# EAGLE design switchotron-3buttons-3lights-v1 (EAGLE 9.6.2)
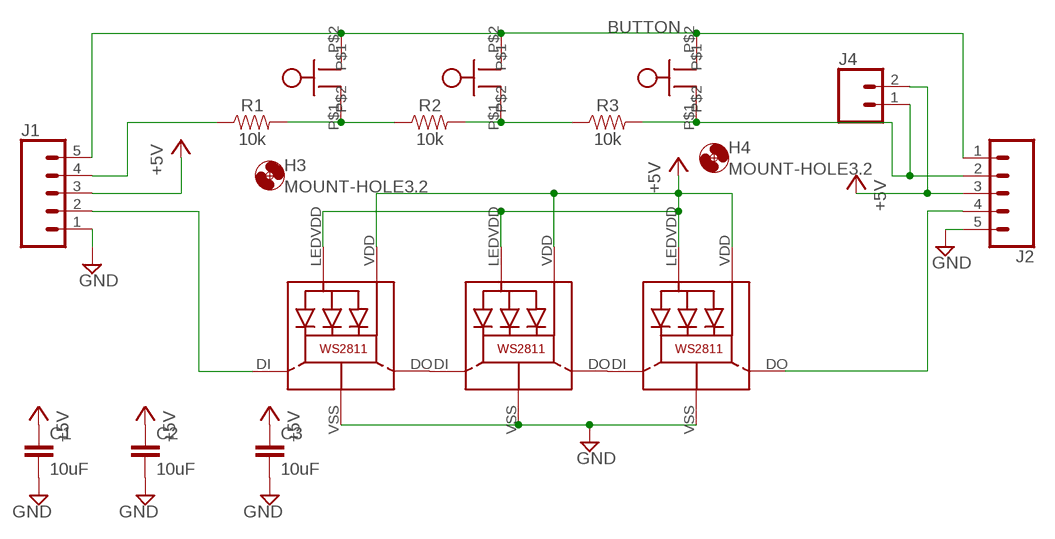
[diagram p0: schematic, sheet 1]

## Parts
C1  10uF  10UF-0603-6.3V-20%  [0603]
C2  10uF  10UF-0603-6.3V-20%  [0603]
C3  10uF  10UF-0603-6.3V-20%  [0603]
H3  MOUNT-HOLE3.2  [3,2]
H4  MOUNT-HOLE3.2  [3,2]
J1  CONN_05  [1X05]
J2  CONN_05  [1X05]
J4  CONN_02  [1X02]
LED1  WS28115050  [WS28115050]
LED2  WS28115050  [WS28115050]
LED8  WS28115050  [WS28115050]
R1  10k  10KOHM-0603-1/10W-1%  [0603]
R2  10k  10KOHM-0603-1/10W-1%  [0603]
R3  10k  10KOHM-0603-1/10W-1%  [0603]
U$1  BUTTON  [BUTTON]
U$4  BUTTON  [BUTTON]
U$5  BUTTON  [BUTTON]

## Nets
+5V: C1.1 C2.1 C3.1 J1.3 J2.3 J4.2 LED1.LEDVDD LED1.VDD LED2.LEDVDD LED2.VDD LED8.LEDVDD LED8.VDD
BUTTON: J1.5 J2.1 U$1.P$2 U$4.P$2 U$5.P$2
GND: C1.2 C2.2 C3.2 J1.1 J2.5 LED1.VSS(GND) LED2.VSS(GND) LED8.VSS(GND)
N$1: LED1.DO LED2.DI
N$2: R1.2 R2.1 U$1.P$1
N$3: R2.2 R3.1 U$4.P$1
N$4: J2.2 J4.1 R3.2 U$5.P$1
N$5: J1.4 R1.1
N$7: LED2.DO LED8.DI
N$8: J1.2 LED1.DI
N$9: J2.4 LED8.DO

## Library data of the parts
C1-C3 = SparkFun-Capacitors:10UF: 10.0µF ceramic capacitors A capacitor is a passive two-terminal electrical component used to store electrical energy temporarily in an electric field.; PROD_ID: CAP-11015
H3 H4 = holes:MOUNT-HOLE: MOUNTING HOLE with drill center marker
J1 J2 = SparkFun-Connectors:CONN_05: Multi connection point. Often used as Generic Header-pin footprint for 0.1 inch spaced/style header connections On any of the 0.1 inch spaced packages, you can populate with these: Break Away Headers - Straight <https://www.sparkfun.com/products/116> (PRT-00116) Break Away Male Headers - Right Angle <https://www.sparkfun.com/products/553> (PRT-00553) Female Headers <https://www.sparkfun.com/products/115> (PRT-00115) Break Away Headers - Machine Pin <https://www.sparkfun.com/products/117> (PRT-00117) Break Away Female Headers - Swiss Machine Pin <https://www.sparkfun.com/products/743> (PRT-00743) For SCREWTERMINALS and SPRING TERMINALS visit here: Screw Terimnals on SparkFun.com <https://www.sparkfun.com/search/results?term=Screw+Terminals> (5mm/3.5mm/2.54mm spacing) This device is also useful as a general connection point to wire up your design to another part of your project. Our various solder wires solder well into these plated through hole pads. Hook-Up Wire - Assortment (Stranded, 22 AWG) <https://www.sparkfun.com/products/11375> (PRT-11375) Hook-Up Wire - Assortment (Solid Core, 22 AWG) <https://www.sparkfun.com/products/11367> (PRT-11367) View the entire wire category on our website here <https://www.sparkfun.com/categories/141> Special notes: Molex polarized connector foot print use with SKU : PRT-08231 with associated crimp pins and housings. 1MM SMD Version SKU: PRT-10208
J4 = SparkFun-Connectors:CONN_02: Multi connection point. Often used as Generic Header-pin footprint for 0.1 inch spaced/style header connections On any of the 0.1 inch spaced packages, you can populate with these: Break Away Headers - Straight <https://www.sparkfun.com/products/116> (PRT-00116) Break Away Male Headers - Right Angle <https://www.sparkfun.com/products/553> (PRT-00553) Female Headers <https://www.sparkfun.com/products/115> (PRT-00115) Break Away Headers - Machine Pin <https://www.sparkfun.com/products/117> (PRT-00117) Break Away Female Headers - Swiss Machine Pin <https://www.sparkfun.com/products/743> (PRT-00743) For SCREWTERMINALS and SPRING TERMINALS visit here: Screw Terimnals on SparkFun.com <https://www.sparkfun.com/search/results?term=Screw+Terminals> (5mm/3.5mm/2.54mm spacing) This device is also useful as a general connection point to wire up your design to another part of your project. Our various solder wires solder well into these plated through hole pads. Hook-Up Wire - Assortment (Stranded, 22 AWG) <https://www.sparkfun.com/products/11375> (PRT-11375) Hook-Up Wire - Assortment (Solid Core, 22 AWG) <https://www.sparkfun.com/products/11367> (PRT-11367) View the entire wire category on our website here <https://www.sparkfun.com/categories/141> Special notes: Molex polarized connector foot print use with: PRT-08233 with associated crimp pins and housings. 2.54_SCREWTERM for use with PRT-10571. 3.5mm Screw Terminal footprints for PRT-08084 5mm Screw Terminal footprints for use with PRT-08432
LED1 LED2 LED8 = microbuilder:WS28115050
R1-R3 = SparkFun-Resistors:10KOHM: 10kΩ resistor A resistor is a passive two-terminal electrical component that implements electrical resistance as a circuit element. Resistors act to reduce current flow, and, at the same time, act to lower voltage levels within circuits. - Wikipedia; PROD_ID: RES-00824
U$1 U$4 U$5 = spietz-library-2:BUTTON

## Board
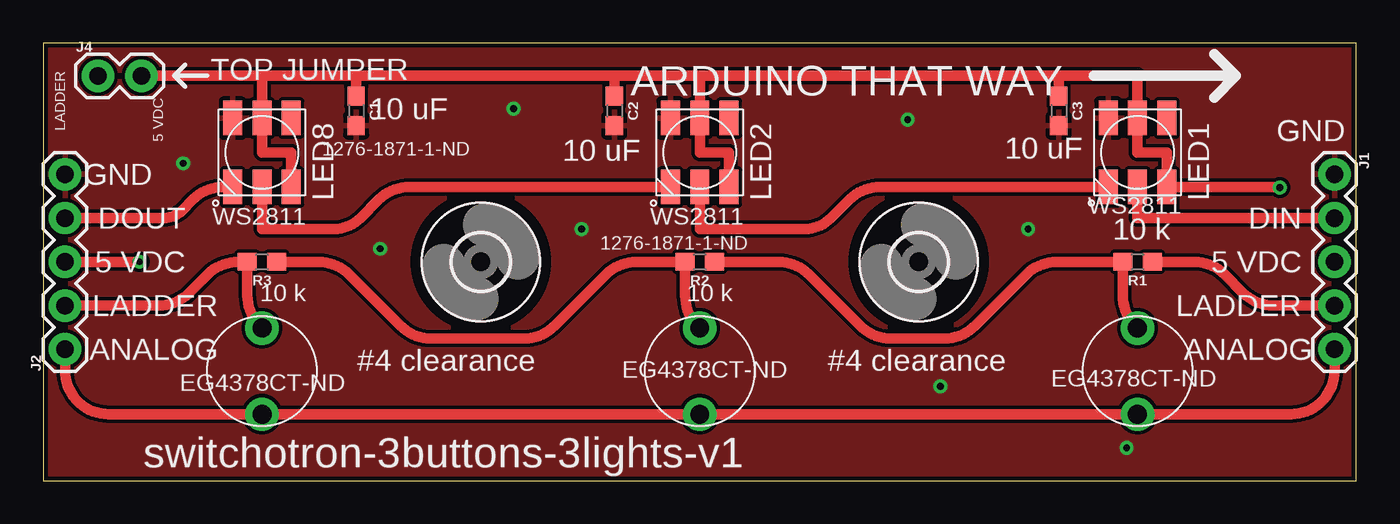
[diagram p1: board, top side]
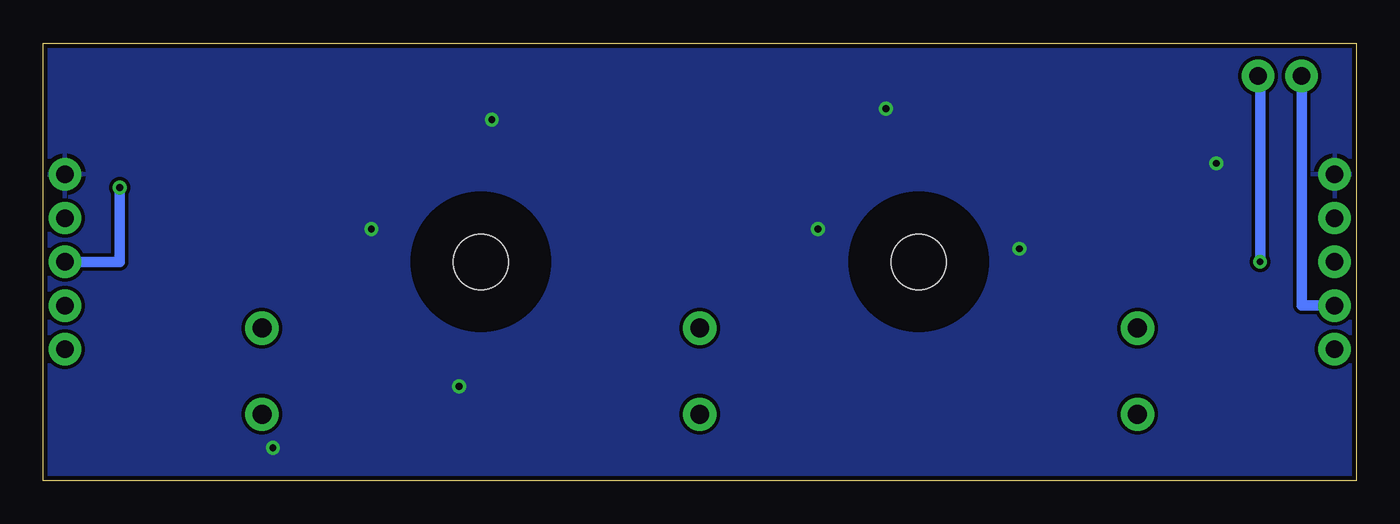
[diagram p2: board, bottom side, seen from below]

Size 76.2 x 25.4 mm. Coordinates in mm from the lower left corner, seen from the top.
Outline: 76.2,25.4 0,25.4 0,0 76.2,0 76.2,25.4
Copper layers (1*16): Top 0.035mm / dielectric 1.5mm / Bottom 0.035mm
Design rules "adafruit *": minimum track width 8mil, minimum drill 15.5mil, track to track 8mil, track to pad 8mil, pad to pad 8mil, via to via 8mil, smd to smd 8mil, copper to edge 10mil, drill to drill 8mil, minimum pad ring 10mil, minimum via ring 8mil, stop-mask expansion 4mil, vias tented up to drill 20mil, thermal gap 10mil

### Footprints (pad centres in the part's own frame; a part is rotated, then mirrored left to right if it is on the bottom)
0603 = smd 1.1 x 1: 1 -0.85,0; 2 0.85,0
3,2 = hole 3.2: 0,0
1X05 = drill 1.016 pad 1.88: 1 0,0; 2 2.54,0; 3 5.08,0; 4 7.62,0; 5 10.16,0
1X02 = drill 1.016 pad 1.88: 1 0,0; 2 2.54,0
WS28115050 = smd 2 x 1.1: DI 2,0; DO 2,-1.7; LEDVDD -2,0; NC -2,1.7; VDD 2,1.7; VSS -2,-1.7
BUTTON = drill 1.1 pad 1.93: P$1 -2.499,0; P$2 2.499,0

### Placement (x,y rotation side)
C1  18.16,21.46 270 top
C2  33.15,21.46 270 top
C3  58.93,21.46 270 top
H3  50.8,12.7 180 top
H4  25.4,12.7 180 top
J1  74.93,17.78 270 top
J2  1.27,7.62 90 top
J4  3.17,23.5 0 top
LED1  63.5,19.05 270 top
LED2  38.1,19.05 270 top
LED8  12.7,19.05 270 top
R1  63.5,12.7 180 top
R2  38.1,12.7 180 top
R3  12.7,12.7 180 top
U$1  63.5,6.35 270 top
U$4  38.1,6.35 270 top
U$5  12.7,6.35 270 top

### Tracks (layer width: path | path; a pad name or v marks a point on that pad's centre or on a via)
+5V  (via drill 0.39)
  Top 0.61: J2.3 v5.59,12.7 | LED8.VDD 14.4,19.05 12.7,19.05 LED8.LEDVDD 12.7,23.5 | J4.2 12.7,23.5 | LED2.VDD 39.8,19.05 38.1,19.05 LED2.LEDVDD 38.1,23.5 | 18.04,23.5 33.15,23.5 | 18.04,23.5 18.16,23.5 C1.1 | 18.04,23.5 12.7,23.5 | 33.15,23.5 38.1,23.5 | 38.1,23.5 58.93,23.5 | 58.93,23.5 63.5,23.5 LED1.LEDVDD 63.5,19.05 65.2,19.05 LED1.VDD 71.75,17.05 v71.75,17.02 | C2.1 33.15,23.5 | C3.1 58.93,23.5
  Bottom 0.61: J1.3 71.75,12.7 v71.75,17.02 | J4.2 5.59,23.5 v5.59,12.7
BUTTON
  Top 0.61: J1.5 74.93,6.39 arc-90 72.39,3.85 U$1.P$2 U$4.P$2 U$5.P$2 3.81,3.85 arc-90 1.27,6.39 J2.1
GND  (via drill 0.39)
  other vias: 62.87,1.91 52.07,5.46 57.15,14.61 27.3,21.59 8.13,18.41 50.16,20.95 19.56,13.46 31.24,14.61
  pour Top: 76.2,0 76.2,25.4 0,25.4 0,0
  pour Bottom: 76.2,0 76.2,25.4 0,25.4 0,0
N$1
  Top 0.61: LED1.DO 48.58,17.05 arc45 46.79,16.31 45.72,15.24 arc-45 44.19,14.61 38.1,14.61 LED2.DI
N$2
  Top 0.61: R2.1 42.64,12.7 arc-45 44.43,11.96 47.39,9 arc45 49.19,8.26 52.29,8.26 arc45 54.08,9 57.04,11.96 arc-45 58.84,12.7 R1.2 62.65,10.75 arc45 63.39,8.96 U$1.P$1
N$3
  Top 0.61: R3.1 15.97,12.7 arc-45 17.76,11.96 20.72,9 arc45 22.52,8.26 27.9,8.26 arc45 29.7,9 32.66,11.96 arc-45 34.45,12.7 R2.2 37.25,10.75 arc45 37.99,8.96 U$4.P$1
N$4
  Top 0.61: J2.2 6.7,10.16 arc45 8.49,10.9 9.54,11.96 arc-45 11.34,12.7 R3.2 11.85,10.75 arc45 12.59,8.96 U$5.P$1
  Bottom 0.61: J4.1 3.17,10.16 J2.2
N$5
  Top 0.61: R1.1 66.77,12.7 arc-45 68.56,11.96 69.61,10.9 arc45 71.41,10.16 J1.4
N$7
  Top 0.61: LED2.DO 21.28,17.05 arc45 19.48,16.31 18.41,15.24 arc-45 16.88,14.61 12.7,14.61 LED8.DI
N$8
  Top 0.61: J1.2 63.5,15.24 LED1.DI
N$9
  Top 0.61: J2.4 6.99,15.24 arc45 8.07,15.69 8.69,16.31 arc-45 10.48,17.05 LED8.DO

### Text on the board
tPlace: TOP JUMPER | ARDUINO THAT WAY | 5 VDC | 10 uF | GND | LADDER | 1276-1871-1-ND | 10 uF | 10 uF | GND | WS2811 | DOUT | WS2811 | WS2811 | DIN | 10 k | 1276-1871-1-ND | 5 VDC | 5 VDC | LADDER | 10 k | 10 k | LADDER | ANALOG | #4 clearance | #4 clearance | ANALOG | EG4378CT-ND | EG4378CT-ND | EG4378CT-ND | switchotron-3buttons-3lights-v1